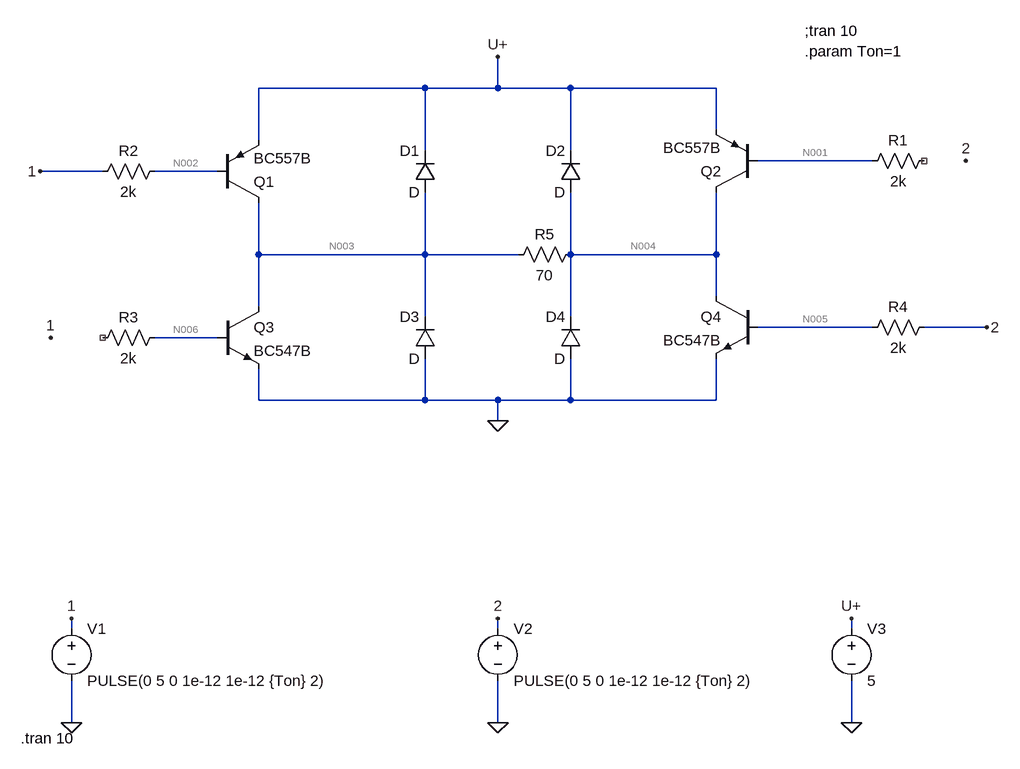
[diagram p0: schematic мостовая 2.asc]
мостовая 2.asc, the LTspice schematic file:
Version 4
SHEET 1 4036 1324
WIRE 1472 160 1216 160
WIRE 1584 160 1584 112
WIRE 1584 160 1472 160
WIRE 1696 160 1584 160
WIRE 1920 160 1696 160
WIRE 1920 224 1920 160
WIRE 1216 240 1216 160
WIRE 1472 256 1472 160
WIRE 1696 256 1696 160
WIRE 2160 272 1984 272
WIRE 976 288 880 288
WIRE 1152 288 1056 288
WIRE 1216 416 1216 336
WIRE 1472 416 1472 320
WIRE 1472 416 1216 416
WIRE 1616 416 1472 416
WIRE 1696 416 1696 320
WIRE 1920 416 1920 320
WIRE 1920 416 1696 416
WIRE 1920 480 1920 416
WIRE 1216 496 1216 416
WIRE 1472 512 1472 416
WIRE 1696 512 1696 416
WIRE 2160 528 1984 528
WIRE 2336 528 2240 528
WIRE 1152 544 1056 544
WIRE 1216 640 1216 592
WIRE 1472 640 1472 576
WIRE 1472 640 1216 640
WIRE 1584 640 1472 640
WIRE 1696 640 1696 576
WIRE 1696 640 1584 640
WIRE 1920 640 1920 576
WIRE 1920 640 1696 640
WIRE 1584 672 1584 640
WIRE 928 992 928 976
WIRE 1584 992 1584 976
WIRE 2128 992 2128 976
WIRE 928 1136 928 1072
WIRE 1584 1136 1584 1072
WIRE 2128 1136 2128 1072
FLAG 928 976 1
FLAG 928 1136 0
FLAG 1584 976 2
FLAG 1584 1136 0
FLAG 2128 976 U+
FLAG 2128 1136 0
FLAG 1584 112 U+
FLAG 1584 672 0
FLAG 880 288 1
FLAG 2336 528 2
FLAG 896 544 1
FLAG 2304 272 2
SYMBOL voltage 928 976 R0
WINDOW 123 0 0 Left 0
WINDOW 39 0 0 Left 0
SYMATTR InstName V1
SYMATTR Value PULSE(0 5 0 1e-12 1e-12 {Ton} 2)
SYMBOL voltage 1584 976 R0
WINDOW 123 0 0 Left 0
WINDOW 39 0 0 Left 0
SYMATTR InstName V2
SYMATTR Value PULSE(0 5 0 1e-12 1e-12 {Ton} 2)
SYMBOL pnp 1152 336 M180
SYMATTR InstName Q1
SYMATTR Value BC557B
SYMBOL pnp 1984 320 R180
SYMATTR InstName Q2
SYMATTR Value BC557B
SYMBOL npn 1152 496 R0
SYMATTR InstName Q3
SYMATTR Value BC547B
SYMBOL npn 1984 480 M0
SYMATTR InstName Q4
SYMATTR Value BC547B
SYMBOL diode 1488 320 R180
WINDOW 0 24 64 Left 2
WINDOW 3 24 0 Left 2
SYMATTR InstName D1
SYMBOL res 1072 272 R90
WINDOW 0 0 56 VBottom 2
WINDOW 3 32 56 VTop 2
SYMATTR InstName R2
SYMATTR Value 2k
SYMBOL voltage 2128 976 R0
WINDOW 123 0 0 Left 0
WINDOW 39 0 0 Left 0
SYMATTR InstName V3
SYMATTR Value 5
SYMBOL diode 1712 320 R180
WINDOW 0 24 64 Left 2
WINDOW 3 24 0 Left 2
SYMATTR InstName D2
SYMBOL diode 1488 576 R180
WINDOW 0 24 64 Left 2
WINDOW 3 24 0 Left 2
SYMATTR InstName D3
SYMBOL diode 1712 576 R180
WINDOW 0 24 64 Left 2
WINDOW 3 24 0 Left 2
SYMATTR InstName D4
SYMBOL res 1712 400 R90
WINDOW 0 0 56 VBottom 2
WINDOW 3 32 56 VTop 2
SYMATTR InstName R5
SYMATTR Value 70
SYMBOL res 2256 512 R90
WINDOW 0 0 56 VBottom 2
WINDOW 3 32 56 VTop 2
SYMATTR InstName R4
SYMATTR Value 2k
SYMBOL res 2256 256 R90
WINDOW 0 0 56 VBottom 2
WINDOW 3 32 56 VTop 2
SYMATTR InstName R1
SYMATTR Value 2k
SYMBOL res 1072 528 R90
WINDOW 0 0 56 VBottom 2
WINDOW 3 32 56 VTop 2
SYMATTR InstName R3
SYMATTR Value 2k
TEXT 2056 72 Left 2 !;tran 10\n.param Ton=1
TEXT 850 1160 Left 2 !.tran 10

The netlist it stands for:
* мостовая 2.asc
V1 1 0 PULSE(0 5 0 1e-12 1e-12 {Ton} 2)
V2 2 0 PULSE(0 5 0 1e-12 1e-12 {Ton} 2)
Q1 N003 N002 U+ 0 BC557B
Q2 N004 N001 U+ 0 BC557B
Q3 N003 N006 0 0 BC547B
Q4 N004 N005 0 0 BC547B
D1 N003 U+ D
R2 N002 1 2k
V3 U+ 0 5
D2 N004 U+ D
D3 0 N003 D
D4 0 N004 D
R5 N004 N003 70
R4 2 N005 2k
R1 NC_01 N001 2k
R3 N006 NC_02 2k
.model D D
.lib standard.dio
.model NPN NPN
.model PNP PNP
.lib standard.bjt
;tran 10
.param Ton=1
.tran 10
.backanno
.end

* Results of the author's LTspice run, read from the files saved beside the schematic
* Operating Point, zero values left out:
*   V(n003) = 4.993 V
*   V(n002) = 4.286 V
*   V(u+) = 5 V
*   V(n004) = 4.993 V
*   V(n001) = 4.994 V
*   V(n006) = 262.9 mV
*   V(n005) = 10.12 nV
*   Ic(Q4) = 5.085 pA
*   Ib(Q4) = -5.059 pA
*   Ic(Q3) = 613.6 pA
*   Ie(Q3) = -613.6 pA
*   Ic(Q1) = -628.7 pA
*   Ib(Q1) = -2.143 mA
*   Ie(Q1) = 2.143 mA
*   I(D4) = -5.003 pA
*   I(D3) = -5.003 pA
*   I(R4) = -5.059 pA
*   I(R5) = -10.06 pA
*   I(R2) = 2.143 mA
*   I(V3) = -2.143 mA
*   I(V2) = 5.059 pA
*   I(V1) = 2.143 mA
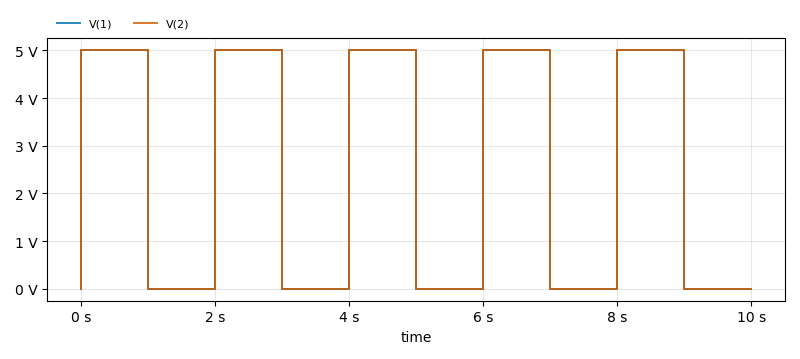
[diagram p1: Transient Analysis of мостовая 2.asc, plotted from the saved traces]
* Transient Analysis, 1 run:
*   V(1): min 0 V, max 5 V, average 2.5 V, rms 3.536 V, last 0 V
*   V(2): min 0 V, max 5 V, average 2.5 V, rms 3.536 V, last 0 V